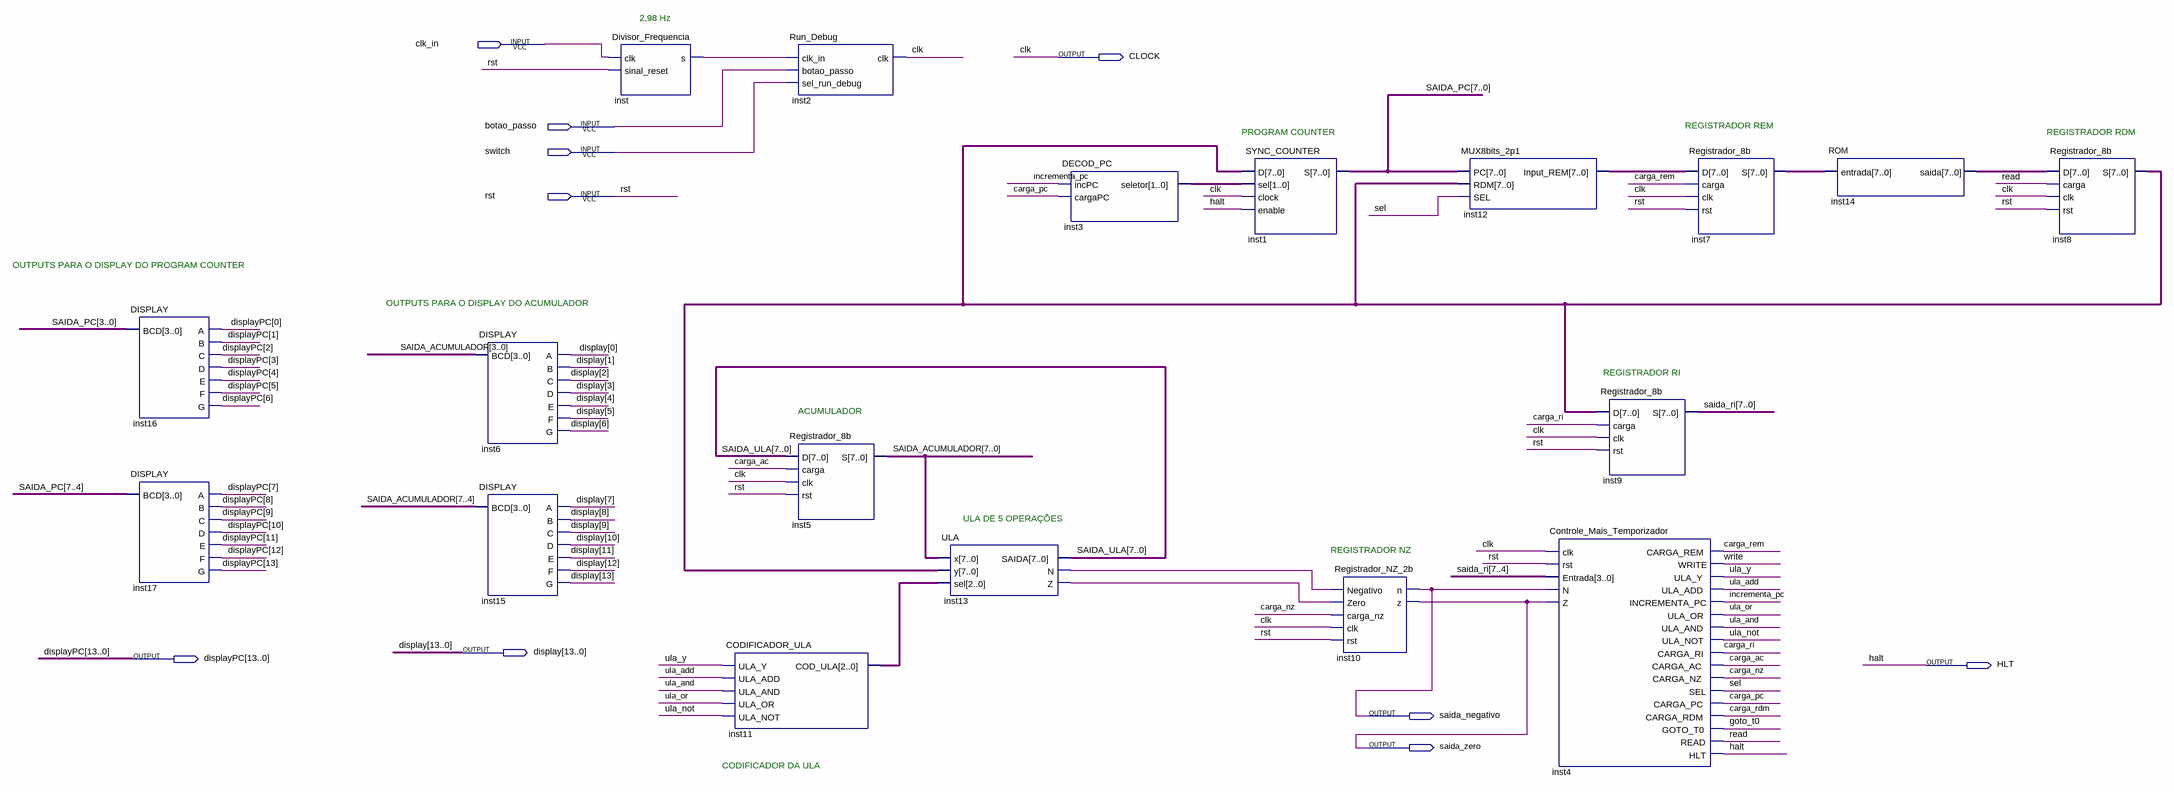
[diagram p0: schematic sheet]
// Quartus schematic Trabalho_Final.bdf as structural Verilog: 18 symbols, 10 pins
module Trabalho_Final (
  input  clk_in,
  input  botao_passo,
  input  switch,
  input  rst,
  output CLOCK,
  output [13:0] display,
  output [13:0] displayPC,
  output HLT,
  output saida_negativo,
  output saida_zero
);

  wire carga_ac, carga_nz, carga_pc, carga_rdm, carga_rem, carga_ri, goto_t0, incrementa_pc, inst13_n,
       inst13_z, inst_s, read, sel, ula_add, ula_and, ula_not, ula_or, ula_y, write;
  wire [1:0] inst3_seletor;
  wire [2:0] inst11_cod_ula;
  wire [7:0] inst7_s, inst8_s, inst12_input_rem, inst14_saida, SAIDA_ACUMULADOR, SAIDA_PC, saida_ri,
       SAIDA_ULA;

  DISPLAY inst16 (
    .BCD(SAIDA_PC[3:0]), .A(displayPC[0]), .B(displayPC[1]), .C(displayPC[2]), .D(displayPC[3]),
    .E(displayPC[4]), .F(displayPC[5]), .G(displayPC[6]));
  DISPLAY inst17 (
    .BCD(SAIDA_PC[7:4]), .A(displayPC[7]), .B(displayPC[8]), .C(displayPC[9]), .D(displayPC[10]),
    .E(displayPC[11]), .F(displayPC[12]), .G(displayPC[13]));
  DISPLAY inst6 (
    .BCD(SAIDA_ACUMULADOR[3:0]), .A(display[0]), .B(display[1]), .C(display[2]), .D(display[3]),
    .E(display[4]), .F(display[5]), .G(display[6]));
  DISPLAY inst15 (
    .BCD(SAIDA_ACUMULADOR[7:4]), .A(display[7]), .B(display[8]), .C(display[9]), .D(display[10]),
    .E(display[11]), .F(display[12]), .G(display[13]));
  Divisor_Frequencia inst (.clk(clk_in), .sinal_reset(rst), .s(inst_s));
  CODIFICADOR_ULA inst11 (
    .ULA_Y(ula_y), .ULA_ADD(ula_add), .ULA_AND(ula_and), .ULA_OR(ula_or), .ULA_NOT(ula_not),
    .COD_ULA(inst11_cod_ula));
  Run_Debug inst2 (.clk_in(inst_s), .botao_passo(botao_passo), .sel_run_debug(switch), .clk(CLOCK));
  Registrador_8b inst5 (.D(SAIDA_ULA), .carga(carga_ac), .clk(CLOCK), .rst(rst), .S(SAIDA_ACUMULADOR));
  ULA inst13 (.x(SAIDA_ACUMULADOR), .y(inst8_s), .sel(inst11_cod_ula), .SAIDA(SAIDA_ULA), .N(inst13_n), .Z(inst13_z));
  DECOD_PC inst3 (.incPC(incrementa_pc), .cargaPC(carga_pc), .seletor(inst3_seletor));
  SYNC_COUNTER inst1 (.D(inst8_s), .sel(inst3_seletor), .clock(CLOCK), .enable(HLT), .S(SAIDA_PC));
  Registrador_NZ_2b inst10 (
    .Negativo(inst13_n), .Zero(inst13_z), .carga_nz(carga_nz), .clk(CLOCK), .rst(rst), .n(saida_negativo),
    .z(saida_zero));
  MUX8bits_2p1 inst12 (.PC(SAIDA_PC), .RDM(inst8_s), .SEL(sel), .Input_REM(inst12_input_rem));
  Controle_Mais_Temporizador inst4 (
    .clk(CLOCK), .rst(rst), .Entrada(saida_ri[7:4]), .N(saida_negativo), .Z(saida_zero),
    .CARGA_REM(carga_rem), .WRITE(write), .ULA_Y(ula_y), .ULA_ADD(ula_add), .INCREMENTA_PC(incrementa_pc),
    .ULA_OR(ula_or), .ULA_AND(ula_and), .ULA_NOT(ula_not), .CARGA_RI(carga_ri), .CARGA_AC(carga_ac),
    .CARGA_NZ(carga_nz), .SEL(sel), .CARGA_PC(carga_pc), .CARGA_RDM(carga_rdm), .GOTO_T0(goto_t0),
    .READ(read), .HLT(HLT));
  Registrador_8b inst9 (.D(inst8_s), .carga(carga_ri), .clk(CLOCK), .rst(rst), .S(saida_ri));
  Registrador_8b inst7 (.D(inst12_input_rem), .carga(carga_rem), .clk(CLOCK), .rst(rst), .S(inst7_s));
  ROM inst14 (.entrada(inst7_s), .saida(inst14_saida));
  Registrador_8b inst8 (.D(inst14_saida), .carga(read), .clk(CLOCK), .rst(rst), .S(inst8_s));

  // Other names for the same wires on the sheet: clk = CLOCK; halt = HLT

  // Notes on the sheet:
  //   2,98 Hz
  //   REGISTRADOR REM    
  //   PROGRAM COUNTER   
  //   REGISTRADOR RDM     
  //   OUTPUTS PARA O DISPLAY DO PROGRAM COUNTER        
  //   OUTPUTS PARA O DISPLAY DO ACUMULADOR       
  //   REGISTRADOR RI    
  //   ACUMULADOR    
  //   ULA DE 5 OPERAÇÕES     
  //   REGISTRADOR NZ  
  //   CODIFICADOR DA ULA   
endmodule
